# EAGLE design SO-16-TSSOP-16-Adapter (EAGLE 7.6.0)
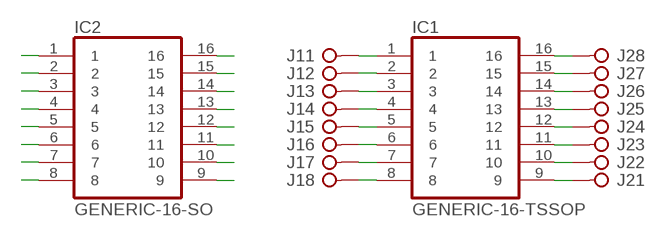
[diagram p0: schematic, sheet 1]

## Parts
IC1  GENERIC-16-TSSOP  [TSSOP-16]
IC2  GENERIC-16-SO  [SO-16]
J1  PINHD-1X8  [1X08]
J2  PINHD-1X8  [1X08]

## Nets
N$1: IC1.1 IC2.16 J1.1
N$2: IC1.2 IC2.15 J1.2
N$3: IC1.3 IC2.14 J1.3
N$4: IC1.4 IC2.13 J1.4
N$5: IC1.5 IC2.12 J1.5
N$6: IC1.6 IC2.11 J1.6
N$7: IC1.7 IC2.10 J1.7
N$8: IC1.8 IC2.9 J1.8
N$9: IC1.9 IC2.8 J2.1
N$10: IC1.10 IC2.7 J2.2
N$11: IC1.11 IC2.6 J2.3
N$12: IC1.12 IC2.5 J2.4
N$13: IC1.13 IC2.4 J2.5
N$14: IC1.14 IC2.3 J2.6
N$15: IC1.15 IC2.2 J2.7
N$16: IC1.16 IC2.1 J2.8

## Library data of the parts
IC1 IC2 = SaintGimp:GENERIC-16
J1 J2 = SaintGimp:PINHD-1X8

## Board
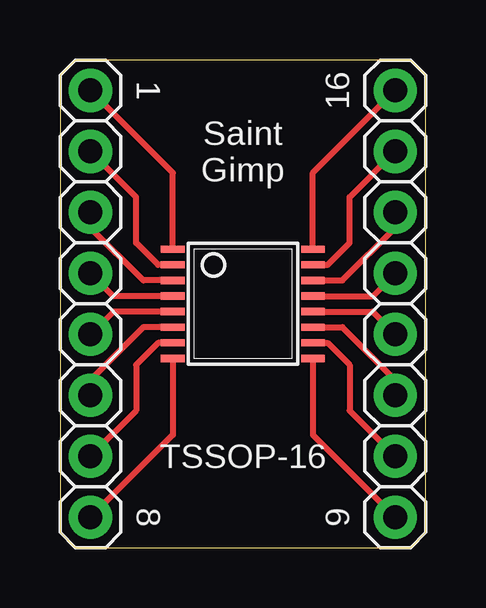
[diagram p1: board, top side]
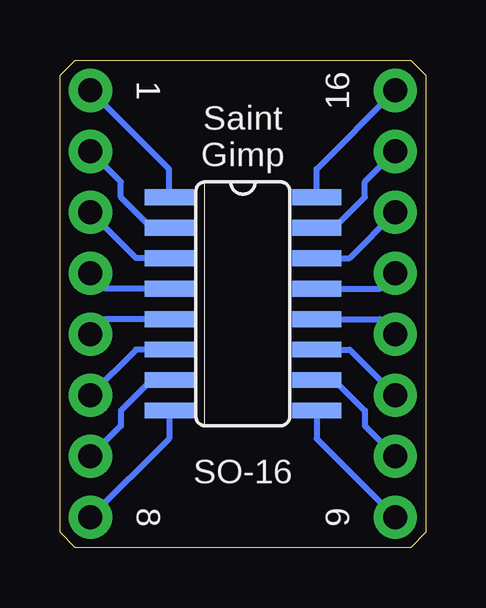
[diagram p2: board, bottom side, seen from below]

Size 15.24 x 20.32 mm. Coordinates in mm from the lower left corner, seen from the top.
Outline: 0,19.68 0,0.64 0.64,0 14.61,0 15.24,0.64 15.24,19.68 14.61,20.32 0.64,20.32 0,19.68
Copper layers (1*16): Top 0.0356mm / dielectric 1.5011mm / Bottom 0.0356mm
Design rules "Saintgimp-OSHPark": minimum track width 10mil, minimum drill 13mil, track to track 6mil, track to pad 6mil, pad to pad 6mil, via to via 6mil, smd to smd 6mil, copper to edge 15mil, drill to drill 6mil, minimum pad ring 12mil, minimum via ring 7mil, stop-mask expansion 2mil, vias tented up to drill 24mil, thermal gap 10mil

### Footprints (pad centres in the part's own frame; a part is rotated, then mirrored left to right if it is on the bottom)
TSSOP-16 = smd 0.305 x 0.991: 1 -2.275,-2.918; 2 -1.625,-2.918; 3 -0.975,-2.918; 4 -0.325,-2.918; 5 0.325,-2.918; 6 0.975,-2.918; 7 1.625,-2.918; 8 2.275,-2.918; 9 2.275,2.918; 10 1.625,2.918; 11 0.975,2.918; 12 0.325,2.918; 13 -0.325,2.918; 14 -0.975,2.918; 15 -1.625,2.918; 16 -2.275,2.918
SO-16 = smd 0.66 x 2.032: 1 -4.445,-3.073; 2 -3.175,-3.073; 3 -1.905,-3.073; 4 -0.635,-3.073; 5 0.635,-3.073; 6 1.905,-3.073; 7 3.175,-3.073; 8 4.445,-3.073; 9 4.445,3.073; 10 3.175,3.073; 11 1.905,3.073; 12 0.635,3.073; 13 -0.635,3.073; 14 -1.905,3.073; 15 -3.175,3.073; 16 -4.445,3.073
1X08 = drill 1: 1 -8.89,0; 2 -6.35,0; 3 -3.81,0; 4 -1.27,0; 5 1.27,0; 6 3.81,0; 7 6.35,0; 8 8.89,0

### Placement (x,y rotation side)
IC1  7.62,10.16 270 top
IC2  7.62,10.16 270 bottom
J1  1.27,10.16 270 top
J2  13.97,10.16 90 top

### Tracks (layer width: path | path; a pad name or v marks a point on that pad's centre or on a via)
N$1
  Top 0.254: IC1.1 4.7,15.62 J1.1
  Bottom 0.254: IC2.16 4.55,15.77 J1.1
N$2
  Top 0.254: IC1.2 4.09,11.79 3.17,12.7 3.17,14.61 J1.2
  Bottom 0.254: IC2.15 3.81,13.34 2.54,14.61 2.54,15.24 J1.2
N$3
  Top 0.254: IC1.3 3.47,11.13 1.27,13.34 J1.3
  Bottom 0.254: IC2.14 3.17,12.06 J1.3
N$4
  Top 0.254: IC1.4 2.21,10.48 J1.4
  Bottom 0.254: IC2.13 1.91,10.79 J1.4
N$5
  Top 0.254: IC1.5 2.21,9.84 J1.5
  Bottom 0.254: IC2.12 1.91,9.53 J1.5
N$6
  Top 0.254: IC1.6 3.47,9.19 1.27,6.99 J1.6
  Bottom 0.254: IC2.11 3.17,8.26 J1.6
N$7
  Top 0.254: IC1.7 4.09,8.54 3.17,7.62 3.17,5.71 J1.7
  Bottom 0.254: IC2.10 3.81,6.99 2.54,5.71 2.54,5.08 J1.7
N$8
  Top 0.254: IC1.8 4.7,4.7 J1.8
  Bottom 0.254: IC2.9 4.55,4.55 J1.8
N$9
  Top 0.254: IC1.9 10.54,4.7 J2.1
  Bottom 0.254: IC2.8 10.69,4.55 J2.1
N$10
  Top 0.254: IC1.10 11.15,8.54 12.06,7.62 12.06,5.71 J2.2
  Bottom 0.254: IC2.7 11.43,6.99 12.7,5.71 12.7,5.08 J2.2
N$11
  Top 0.254: IC1.11 11.77,9.19 13.97,6.99 J2.3
  Bottom 0.254: IC2.6 12.06,8.26 J2.3
N$12
  Top 0.254: IC1.12 13.03,9.84 J2.4
  Bottom 0.254: IC2.5 13.34,9.53 J2.4
N$13
  Top 0.254: IC1.13 13.03,10.48 J2.5
  Bottom 0.254: IC2.4 13.34,10.79 J2.5
N$14
  Top 0.254: IC1.14 11.77,11.13 13.97,13.34 J2.6
  Bottom 0.254: IC2.3 12.06,12.06 J2.6
N$15
  Top 0.254: IC1.15 11.15,11.79 12.06,12.7 12.06,14.61 J2.7
  Bottom 0.254: IC2.2 11.43,13.34 12.7,14.61 12.7,15.24 J2.7
N$16
  Top 0.254: IC1.16 10.54,15.62 J2.8
  Bottom 0.254: IC2.1 10.69,15.77 J2.8

### Text on the board
_tsilk: 1 | 16 | Saint / Gimp | TSSOP-16 | 8 | 9
_bsilk: 16 | 1 | Saint / Gimp | SO-16 | 9 | 8